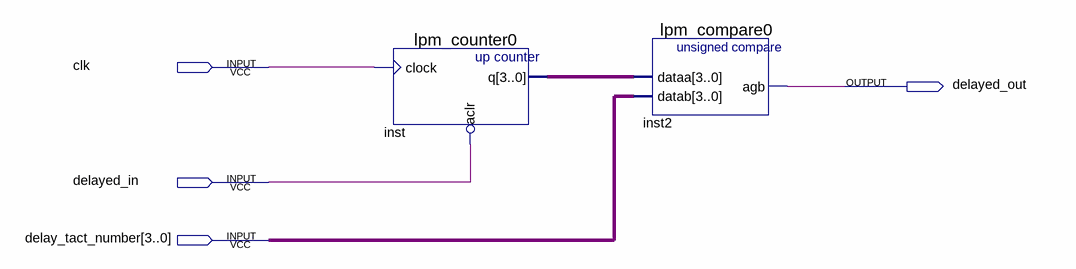
[diagram p0: schematic sheet]
// Quartus schematic delay.bdf as structural Verilog: 2 symbols, 4 pins
module delay (
  input  clk,
  input  delayed_in,
  input  [3:0] delay_tact_number,
  output delayed_out
);

  wire [3:0] inst_q;

  lpm_counter0 inst (.clock(clk), .aclr(~delayed_in), .q(inst_q));
  lpm_compare0 inst2 (.dataa(inst_q), .datab(delay_tact_number), .agb(delayed_out));
endmodule
